# Altium schematic sheet POWER_ANALOG.SchDoc
size 558 x 431 mm; SheetNumber: 21; SheetTotal: 25; Sheet_Name: POWER; Size: 11x17
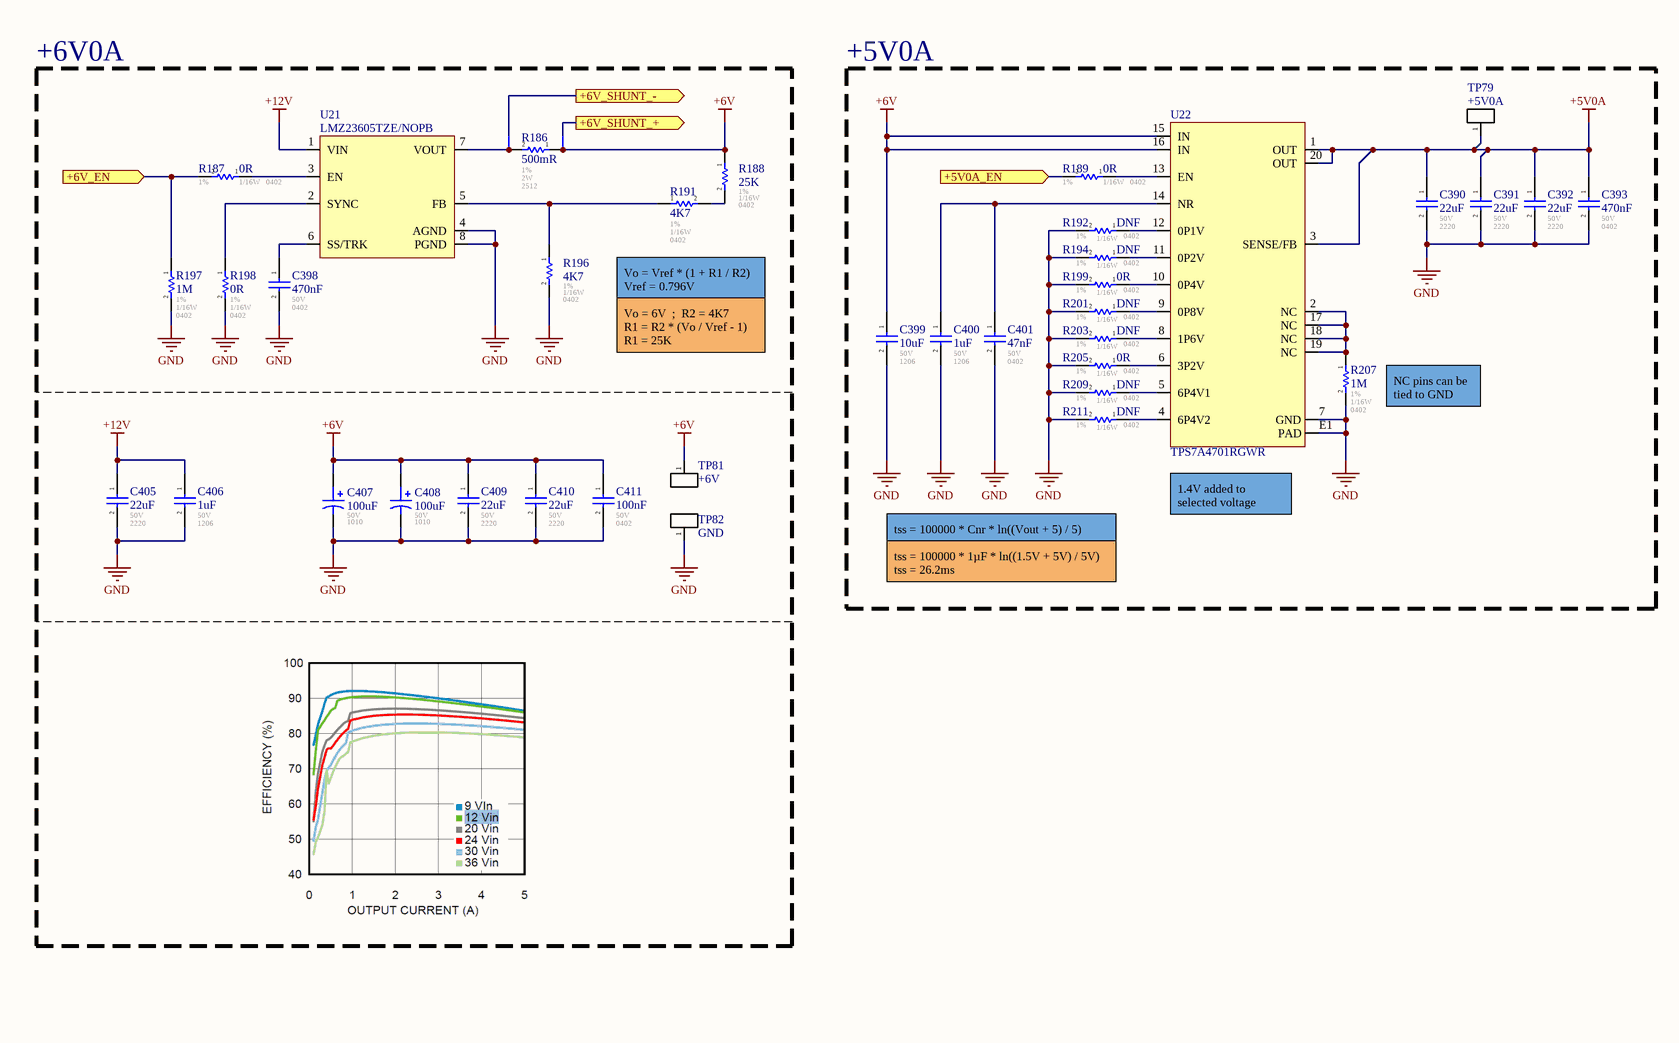
[diagram p0: POWER_ANALOG.SchDoc, top left]
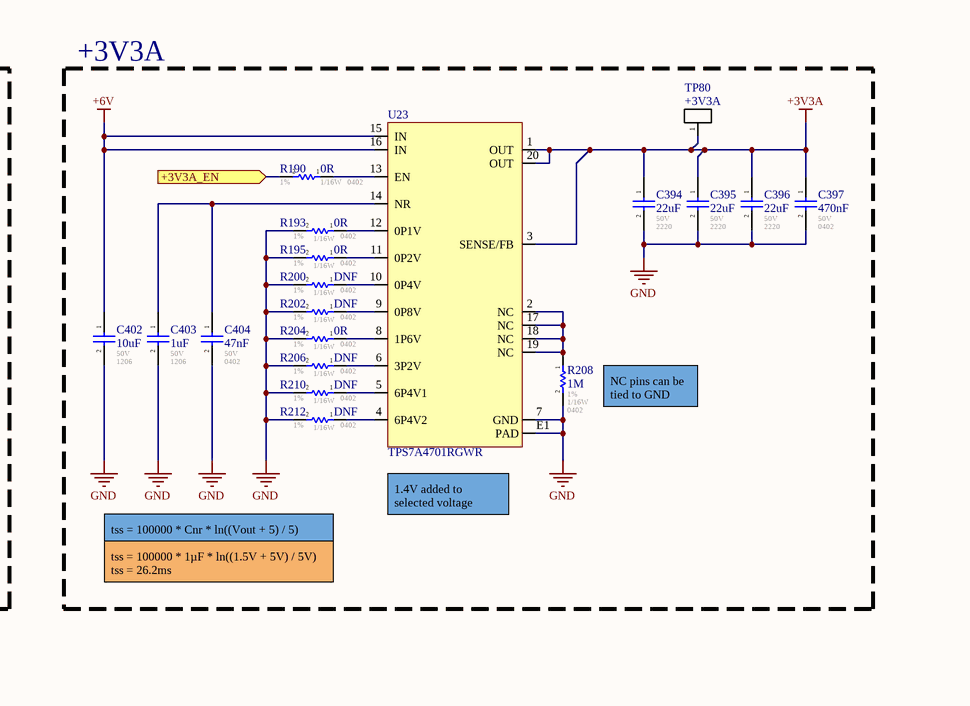
[diagram p1: POWER_ANALOG.SchDoc, top right]
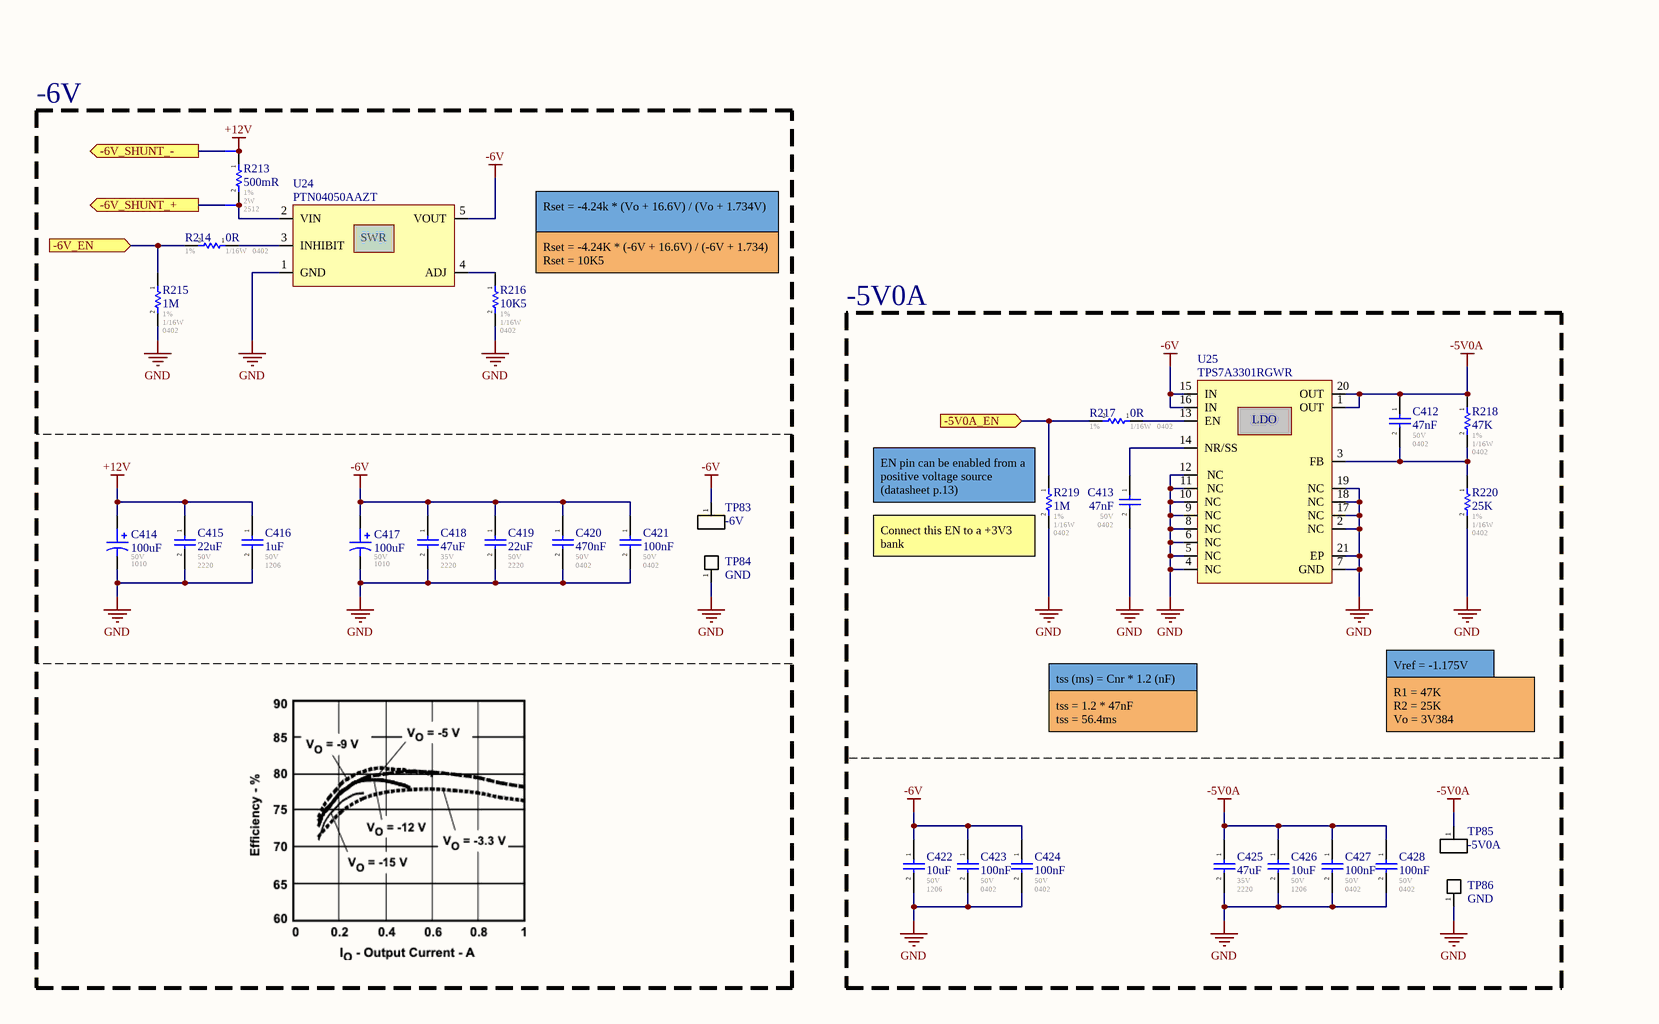
[diagram p2: POWER_ANALOG.SchDoc, bottom left]
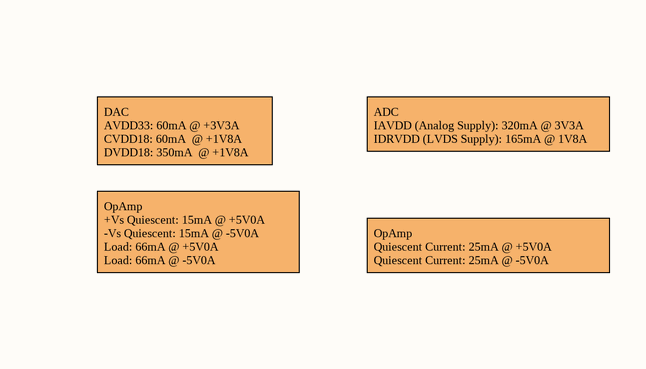
[diagram p3: POWER_ANALOG.SchDoc, bottom right]

## Parts
C390  22uF  Voltage - Rated: 50V  Footprint: 2220  [CAP_2220]
C391  22uF  Voltage - Rated: 50V  Footprint: 2220  [CAP_2220]
C392  22uF  Voltage - Rated: 50V  Footprint: 2220  [CAP_2220]
C393  470nF  Voltage - Rated: 50V  Footprint: 0402  [CAP_0402]
C394  22uF  Voltage - Rated: 50V  Footprint: 2220  [CAP_2220]
C395  22uF  Voltage - Rated: 50V  Footprint: 2220  [CAP_2220]
C396  22uF  Voltage - Rated: 50V  Footprint: 2220  [CAP_2220]
C397  470nF  Voltage - Rated: 50V  Footprint: 0402  [CAP_0402]
C398  470nF  Voltage - Rated: 50V  Footprint: 0402  [CAP_0402]
C399  10uF  Voltage - Rated: 50V  Footprint: 1206  [CAP_1206]
C400  1uF  Voltage - Rated: 50V  Footprint: 1206  [CAP_1206]
C401  47nF  Voltage - Rated: 50V  Footprint: 0402  [CAP_0402]
C402  10uF  Voltage - Rated: 50V  Footprint: 1206  [CAP_1206]
C403  1uF  Voltage - Rated: 50V  Footprint: 1206  [CAP_1206]
C404  47nF  Voltage - Rated: 50V  Footprint: 0402  [CAP_0402]
C405  22uF  Voltage - Rated: 50V  Footprint: 2220  [CAP_2220]
C406  1uF  Voltage - Rated: 50V  Footprint: 1206  [CAP_1206]
C407  value 100uF  Voltage: 50V  Package: 1010  [CAP_ALU_1010_vishay]  (hidden comment: MAL215099101E3)
C408  value 100uF  Voltage: 50V  Package: 1010  [CAP_ALU_1010_vishay]  (hidden comment: MAL215099101E3)
C409  22uF  Voltage - Rated: 50V  Footprint: 2220  [CAP_2220]
C410  22uF  Voltage - Rated: 50V  Footprint: 2220  [CAP_2220]
C411  100nF  Voltage - Rated: 50V  Footprint: 0402  [CAP_0402]
C412  47nF  Voltage - Rated: 50V  Footprint: 0402  [CAP_0402]
C413  47nF  Voltage - Rated: 50V  Footprint: 0402  [CAP_0402]
C414  value 100uF  Voltage: 50V  Package: 1010  [CAP_ALU_1010_vishay]  (hidden comment: MAL215099101E3)
C415  22uF  Voltage - Rated: 50V  Footprint: 2220  [CAP_2220]
C416  1uF  Voltage - Rated: 50V  Footprint: 1206  [CAP_1206]
C417  value 100uF  Voltage: 50V  Package: 1010  [CAP_ALU_1010_vishay]  (hidden comment: MAL215099101E3)
C418  47uF  Voltage - Rated: 35V  Footprint: 2220  [CAP_2220]
C419  22uF  Voltage - Rated: 50V  Footprint: 2220  [CAP_2220]
C420  470nF  Voltage - Rated: 50V  Footprint: 0402  [CAP_0402]
C421  100nF  Voltage - Rated: 50V  Footprint: 0402  [CAP_0402]
C422  10uF  Voltage - Rated: 50V  Footprint: 1206  [CAP_1206]
C423  100nF  Voltage - Rated: 50V  Footprint: 0402  [CAP_0402]
C424  100nF  Voltage - Rated: 50V  Footprint: 0402  [CAP_0402]
C425  47uF  Voltage - Rated: 35V  Footprint: 2220  [CAP_2220]
C426  10uF  Voltage - Rated: 50V  Footprint: 1206  [CAP_1206]
C427  100nF  Voltage - Rated: 50V  Footprint: 0402  [CAP_0402]
C428  100nF  Voltage - Rated: 50V  Footprint: 0402  [CAP_0402]
NT40  Net Tie  [NETTIE_5]  (value not drawn)  (net tie, no BOM)
NT41  Net Tie  [NETTIE_5]  (value not drawn)  (net tie, no BOM)
NT42  Net Tie  [NETTIE_5]  (value not drawn)  (net tie, no BOM)
NT43  Net Tie  [NETTIE_5]  (value not drawn)  (net tie, no BOM)
R186  500mR  Tolerance: 1%  Power: 2W  Package / Case: 2512  [RES_2512]
R187  0R  Tolerance: 1%  Power: 1/16W  Package / Case: 0402  [RES_0402]
R188  25K  Tolerance: 1%  Power: 1/16W  Package / Case: 0402  [RES_0402]
R189  0R  Tolerance: 1%  Power: 1/16W  Package / Case: 0402  [RES_0402]
R190  0R  Tolerance: 1%  Power: 1/16W  Package / Case: 0402  [RES_0402]
R191  4K7  Tolerance: 1%  Power: 1/16W  Package / Case: 0402  [RES_0402]
R192  DNF  Tolerance: 1%  Power: 1/16W  Package / Case: 0402  [RES_0402]
R193  0R  Tolerance: 1%  Power: 1/16W  Package / Case: 0402  [RES_0402]
R194  DNF  Tolerance: 1%  Power: 1/16W  Package / Case: 0402  [RES_0402]
R195  0R  Tolerance: 1%  Power: 1/16W  Package / Case: 0402  [RES_0402]
R196  4K7  Tolerance: 1%  Power: 1/16W  Package / Case: 0402  [RES_0402]
R197  1M  Tolerance: 1%  Power: 1/16W  Package / Case: 0402  [RES_0402]
R198  0R  Tolerance: 1%  Power: 1/16W  Package / Case: 0402  [RES_0402]
R199  0R  Tolerance: 1%  Power: 1/16W  Package / Case: 0402  [RES_0402]
R200  DNF  Tolerance: 1%  Power: 1/16W  Package / Case: 0402  [RES_0402]
R201  DNF  Tolerance: 1%  Power: 1/16W  Package / Case: 0402  [RES_0402]
R202  DNF  Tolerance: 1%  Power: 1/16W  Package / Case: 0402  [RES_0402]
R203  DNF  Tolerance: 1%  Power: 1/16W  Package / Case: 0402  [RES_0402]
R204  0R  Tolerance: 1%  Power: 1/16W  Package / Case: 0402  [RES_0402]
R205  0R  Tolerance: 1%  Power: 1/16W  Package / Case: 0402  [RES_0402]
R206  DNF  Tolerance: 1%  Power: 1/16W  Package / Case: 0402  [RES_0402]
R207  1M  Tolerance: 1%  Power: 1/16W  Package / Case: 0402  [RES_0402]
R208  1M  Tolerance: 1%  Power: 1/16W  Package / Case: 0402  [RES_0402]
R209  DNF  Tolerance: 1%  Power: 1/16W  Package / Case: 0402  [RES_0402]
R210  DNF  Tolerance: 1%  Power: 1/16W  Package / Case: 0402  [RES_0402]
R211  DNF  Tolerance: 1%  Power: 1/16W  Package / Case: 0402  [RES_0402]
R212  DNF  Tolerance: 1%  Power: 1/16W  Package / Case: 0402  [RES_0402]
R213  500mR  Tolerance: 1%  Power: 2W  Package / Case: 2512  [RES_2512]
R214  0R  Tolerance: 1%  Power: 1/16W  Package / Case: 0402  [RES_0402]
R215  1M  Tolerance: 1%  Power: 1/16W  Package / Case: 0402  [RES_0402]
R216  10K5  Tolerance: 1%  Power: 1/16W  Package / Case: 0402  [RES_0402]
R217  0R  Tolerance: 1%  Power: 1/16W  Package / Case: 0402  [RES_0402]
R218  47K  Tolerance: 1%  Power: 1/16W  Package / Case: 0402  [RES_0402]
R219  1M  Tolerance: 1%  Power: 1/16W  Package / Case: 0402  [RES_0402]
R220  25K  Tolerance: 1%  Power: 1/16W  Package / Case: 0402  [RES_0402]
TP79  +5V0A  [TP_HOLE]  (no BOM)
TP80  +3V3A  [TP_HOLE]  (no BOM)
TP81  +6V  [TP_HOLE]  (no BOM)
TP82  GND  [TP_HOLE]  (no BOM)
TP83  -6V  [TP_HOLE]  (no BOM)
TP84  GND  [TP_PAD]  (no BOM)
TP85  -5V0A  [TP_HOLE]  (no BOM)
TP86  GND  [TP_PAD]  (no BOM)
U21  LMZ23605TZE/NOPB  [REG_SWR_LMZ23605TZE/NOPB]
U22  TPS7A4701RGWR  [REG_TPS7A4701RGWR]
U23  TPS7A4701RGWR  [REG_TPS7A4701RGWR]
U24  PTN04050AAZT  [REG_SWR_PTN04050AAZT]
U25  TPS7A3301RGWR  [REG_LDO_TPS7A3301RGWR]

## Blocks framed on the sheet
+6V0A: C398 C405-C411 NT40 NT41 R186-R188 R191 R196-R198 TP81 TP82 U21
+5V0A: C390-C393 C399-C401 R189 R192 R194 R199 R201 R203 R205 R207 R209 R211 TP79 U22
+3V3A: C394-C397 C402-C404 R190 R193 R195 R200 R202 R204 R206 R208 R210 R212 TP80 U23
-6V: C414-C421 NT42 NT43 R213-R216 TP83 TP84 U24
-5V0A: C412 C413 C422-C428 R217-R220 TP85 TP86 U25

## Ports
+3V3A_EN (in), +5V0A_EN (in), +6V_EN (in), +6V_SHUNT_+ (out), +6V_SHUNT_- (out), -5V0A_EN (in), -6V_EN (in), -6V_SHUNT_+ (out), -6V_SHUNT_- (out)

## Nets
+3V3A: C394.1 C395.1 C396.1 C397.1 TP80.1(A) U23.1(OUT) U23.3(SENSE/FB) U23.20(OUT)
+5V0A: C390.1 C391.1 C392.1 C393.1 TP79.1(A) U22.1(OUT) U22.3(SENSE/FB) U22.20(OUT)
+6V: C399.1 C402.1 C407.1 C408.1 C409.1 C410.1 C411.1 NT41.1 R186.1 R188.1 TP81.1(A) U22.15(IN) U22.16(IN) U23.15(IN) U23.16(IN)
+12V: C405.1 C406.1 C414.1 C415.1 C416.1 NT42.1 R213.1 U21.1(VIN)
-5V0A: C412.1 C425.1 C426.1 C427.1 C428.1 R218.1 TP85.1(A) U25.1(OUT) U25.20(OUT)
-6V: C417.1 C418.1 C419.1 C420.1 C421.1 C422.1 C423.1 C424.1 TP83.1(A) U24.5(VOUT) U25.15(IN) U25.16(IN)
GND: C390.2 C391.2 C392.2 C393.2 C394.2 C395.2 C396.2 C397.2 C398.2 C399.2 C400.2 C401.2 C402.2 C403.2 C404.2 C405.2 C406.2 C407.2 C408.2 C409.2 C410.2 C411.2 C413.2 C414.2 C415.2 C416.2 C417.2 C418.2 C419.2 C420.2 C421.2 C422.2 C423.2 C424.2 C425.2 C426.2 C427.2 C428.2 R192.2 R193.2 R194.2 R195.2 R196.2 R197.2 R198.2 R199.2 R200.2 R201.2 R202.2 R203.2 R204.2 R205.2 R206.2 R207.2 R208.2 R209.2 R210.2 R211.2 R212.2 R215.2 R216.2 R219.2 R220.2 TP82.1(A) TP84.1(A) TP86.1(A) U21.4(AGND) U21.8(PGND) U22.7(GND) U22.E1(PAD) U23.7(GND) U23.E1(PAD) U24.1(GND) U25.2(NC) U25.4(NC) U25.5(NC) U25.6(NC) U25.7(GND) U25.8(NC) U25.9(NC) U25.10(NC) U25.11(NC) U25.12(NC) U25.17(NC) U25.18(NC) U25.19(NC) U25.21(EP)
+3V3A_EN: R190.2 ; port +3V3A_EN
+5V0A_EN: R189.2 ; port +5V0A_EN
+6V_EN: R187.2 R197.1 ; port +6V_EN
+6V_SHUNT_+: NT41.2 ; port +6V_SHUNT_+
+6V_SHUNT_-: NT40.2 ; port +6V_SHUNT_-
-5V0A_EN: R217.2 R219.1 ; port -5V0A_EN
-6V_EN: R214.2 R215.1 ; port -6V_EN
-6V_SHUNT_+: NT43.2 ; port -6V_SHUNT_+
-6V_SHUNT_-: NT42.2 ; port -6V_SHUNT_-
NetC398_1: C398.1 U21.6(SS/TRK)
NetC400_1: C400.1 C401.1 U22.14(NR)
NetC403_1: C403.1 C404.1 U23.14(NR)
NetC412_2: C412.2 R218.2 R220.1 U25.3(FB)
NetC413_1: C413.1 U25.14(NR/SS)
NetNT40_1: NT40.1 R186.2 U21.7(VOUT)
NetNT43_1: NT43.1 R213.2 U24.2(VIN)
NetR187_1: R187.1 U21.3(EN)
NetR188_2: R188.2 R191.2
NetR189_1: R189.1 U22.13(EN)
NetR190_1: R190.1 U23.13(EN)
NetR191_1: R191.1 R196.1 U21.5(FB)
NetR192_1: R192.1 U22.12(0P1V)
NetR193_1: R193.1 U23.12(0P1V)
NetR194_1: R194.1 U22.11(0P2V)
NetR195_1: R195.1 U23.11(0P2V)
NetR198_1: R198.1 U21.2(SYNC)
NetR199_1: R199.1 U22.10(0P4V)
NetR200_1: R200.1 U23.10(0P4V)
NetR201_1: R201.1 U22.9(0P8V)
NetR202_1: R202.1 U23.9(0P8V)
NetR203_1: R203.1 U22.8(1P6V)
NetR204_1: R204.1 U23.8(1P6V)
NetR205_1: R205.1 U22.6(3P2V)
NetR206_1: R206.1 U23.6(3P2V)
NetR207_1: R207.1 U22.2(NC) U22.17(NC) U22.18(NC) U22.19(NC)
NetR208_1: R208.1 U23.2(NC) U23.17(NC) U23.18(NC) U23.19(NC)
NetR209_1: R209.1 U22.5(6P4V1)
NetR210_1: R210.1 U23.5(6P4V1)
NetR211_1: R211.1 U22.4(6P4V2)
NetR212_1: R212.1 U23.4(6P4V2)
NetR214_1: R214.1 U24.3(INHIBIT)
NetR216_1: R216.1 U24.4(ADJ)
NetR217_1: R217.1 U25.13(EN)

## Notes on the sheet
- Vo = Vref * (1 + R1 / R2)
  Vref = 0.796V
- Vo = 6V  ;  R2 = 4K7
  R1 = R2 * (Vo / Vref - 1)
  R1 = 25K
- (near R207) NC pins can be tied to GND
- (near R208) NC pins can be tied to GND
- tss = 100000 * Cnr * ln((Vout + 5) / 5)
- (near U22) 1.4V added to selected voltage
- (near U23) 1.4V added to selected voltage
- tss = 100000 * 1µF * ln((1.5V + 5V) / 5V)
  tss = 26.2ms
- Rset = -4.24k * (Vo + 16.6V) / (Vo + 1.734V)
- (near R216) Rset = -4.24K * (-6V + 16.6V) / (-6V + 1.734)
  Rset = 10K5
- (near R219) EN pin can be enabled from a positive voltage source
  (datasheet p.13)
- (near R219) Connect this EN to a +3V3 bank
- Vref = -1.175V
- ADC
  IAVDD (Analog Supply): 320mA @ 3V3A
  IDRVDD (LVDS Supply): 165mA @ 1V8A
- tss (ms) = Cnr * 1.2 (nF)
- tss = 1.2 * 47nF
  tss = 56.4ms
- R1 = 47K
  R2 = 25K
  Vo = 3V384
- DAC
  AVDD33: 60mA @ +3V3A
  CVDD18: 60mA  @ +1V8A
  DVDD18: 350mA  @ +1V8A
- OpAmp
  +Vs Quiescent: 15mA @ +5V0A
  -Vs Quiescent: 15mA @ -5V0A
  Load: 66mA @ +5V0A
  Load: 66mA @ -5V0A
- OpAmp
  Quiescent Current: 25mA @ +5V0A
  Quiescent Current: 25mA @ -5V0A
- Sheet Name
- Project Title
- Global Project
- Revision
- Size
- Date
- Group
- Sheet
- of
- Filename
- Designers
- (in symbol REG_LDO_TPS7A3301RGWR) LDO
- (in symbol REG_SWR_PTN04050AAZT) SWR

## Library data of the parts
C390-C392 C394-C396 C405 C409 C410 C415 C419 = CAP_CER: CGA9P3X7R1H226M250KB / 2220 22uF 20% X7R Ceramic Capacitor; Mfr: TDK; Operating Temperature: -55C - 125C; Temperature Coefficient: X7R; ComponentLink1Description: Digikey; ComponentLink1URL: https://www.digikey.ca/en/products/detail/tdk-corporation/CGA9P3X7R1H226M250KB/10240627; ComponentLink2Description: Datasheet; ComponentLink2URL: https://product.tdk.com/system/files/dam/doc/product/capacitor/ceramic/mlcc/charasheet/cga9p3x7r1h226m250kb.pdf; Tolerance: 20%; Ratings: AEC-Q200; Part#: CGA9P3X7R1H226M250KB; Supplier 1: Arrow Electronics; Supplier Part Number 1: CGA9P3X7R1H226M250KB; ComponentLink3Description: TDK; ComponentLink3URL: https://product.tdk.com/en/search/capacitor/ceramic/mlcc/info?part_no=CGA9P3X7R1H226M250KB; ComponentLink4Description: Octopart; ComponentLink4URL: https://octopart.com/cga9p3x7r1h226m250kb-tdk-102764996?r=sp
C393 C397 C398 C420 = CAP_CER: CGA3E3X7R1H474K080AB / 0603 470nF 10% X7R Ceramic Capacitor; Mfr: TDK; Operating Temperature: -55C - 125C; Temperature Coefficient: X7R; ComponentLink1Description: Digikey; ComponentLink1URL: [Digikey Link]; Part#: CGA3E3X7R1H474K080AB; ComponentLink2Description: Datasheet; ComponentLink2URL: [Datasheet Link]; Tolerance: 10%; Ratings: AEC-Q200
C399 C402 C422 C426 = CAP_CER: GRT31CR61H106KE01L / 1206 10uF 10% X5R Ceramic Capacitor; Mfr: Murata; Operating Temperature: -55C - 85C; Temperature Coefficient: X5R; ComponentLink1Description: Digikey; ComponentLink1URL: [Digikey Link]; ComponentLink2Description: Datasheet; ComponentLink2URL: [Datasheet Link]; Tolerance: 10%; Ratings: AEC-Q200; Supplier 1: Arrow Electronics; Supplier Part Number 1: GRT31CR61H106KE01L; Part#: GRT31CR61H106KE01L
C400 C403 C406 C416 = CAP_CER: GCJ31CR71H105KA12L / 1206 1uF 10% X7R Ceramic Capacitor; Mfr: Murata; Operating Temperature: -55C - 125C; Temperature Coefficient: X7R; ComponentLink1Description: Digikey; ComponentLink1URL: [Digikey Link]; Part#: GCJ31CR71H105KA12L; ComponentLink2Description: Datasheet; ComponentLink2URL: [Datasheet Link]; Tolerance: 10%; Ratings: AEC-Q200
C401 C404 C412 C413 = CAP_CER: GCM155R71H473KE02J / 0402 47nF 10% X7R Ceramic Capacitor; Mfr: Murata; Operating Temperature: -55C - 125C; Temperature Coefficient: X7R; ComponentLink1Description: Digikey; ComponentLink1URL: [Digikey Link]; Part#: GCM155R71H473KE02J; ComponentLink2Description: Datasheet; ComponentLink2URL: [Datasheet Link]; Tolerance: 10%; Ratings: AEC-Q200
C407 C408 C414 C417 = CAP_ALU_MAL215099101E3: CAP - ALU 100uF 20% 50V - 1010; Current: 490mA; Mfg: Vishay Dale; Mfg Part Number: MAL215099101E3; HelpURL: http://www.vishay.com/docs/28395/150crz.pdf; CreatedBy: Jonathan Bouchard; Temperature: -55°C to 125°C; Power: *; Supplier 1: Digikey; Supplier Part Number 1: 4399PHDKR-ND; Precision: 20%
C411 C421 C423 C424 C427 C428 = CAP_CER: GCM155R71H104KE02J / 0402 100nF 10% X7R Ceramic Capacitor; Mfr: Murata; Operating Temperature: -55C - 125C; Temperature Coefficient: X7R; ComponentLink1Description: Digikey; ComponentLink1URL: [Digikey Link]; Part#: GCM155R71H104KE02J; ComponentLink2Description: Datasheet; ComponentLink2URL: [Datasheet Link]; Tolerance: 10%; Ratings: AEC-Q200
C418 C425 = CAP_CER: CGA9N1X7R1V476M230KC / 2220 47uF 20% X7R Ceramic Capacitor; Mfr: TDK; Operating Temperature: -55C - 125C; Temperature Coefficient: X7R; ComponentLink1Description: Digikey; ComponentLink1URL: https://www.digikey.ca/en/products/detail/tdk-corporation/CGA9N1X7R1V476M230KC/15930202; ComponentLink2Description: Datasheet; ComponentLink2URL: https://product.tdk.com/system/files/dam/doc/product/capacitor/ceramic/mlcc/catalog/mlcc_automotive_general_en.pdf; Tolerance: 20%; Ratings: AEC-Q200; Part#: CGA9N1X7R1V476M230KC; ComponentLink3Description: TDK; ComponentLink3URL: https://product.tdk.com/en/search/capacitor/ceramic/mlcc/info?part_no=CGA9N1X7R1V476M230KC; ComponentLink4Description: Octopart; ComponentLink4URL: https://octopart.com/cga9n1x7r1v476m230kc-tdk-122377816?r=sp; Supplier 1: Newark; Supplier Part Number 1: 57AK9414
NT40-NT43 = NET_TIE_SMALL
R186 R213 = RESISTOR: Part #: CSRN2512FKR500; Automotive: AEC-Q200; Operating Temperature: -55C - 155C; ComponentLink1Description: Digikey; ComponentLink1URL: https://www.digikey.ca/fr/products/detail/stackpole-electronics-inc/CSRN2512FKR500/1742768
R187-R196 R198-R206 R209-R212 R214 R216-R218 R220 = RESISTOR: Automotive: AEC-Q200; Operating Temperature: *; # Digikey: *; ComponentLink1Description: Digikey; ComponentLink1URL: *; # Manufacturer: *
R197 R207 R208 R215 R219 = RESISTOR: 1M 0402 1% 1/16W Resistor; Automotive: AEC-Q200; Operating Temperature: *; # Digikey: *; ComponentLink1Description: Digikey; ComponentLink1URL: *; # Manufacturer: *
TP79-TP83 TP85 = TESTPOINT: Test Point; ClassName: Testpoint
TP84 TP86 = TESTPOINT_PAD: Test Point
U21 = REG_SWR_LMZ23605TZE/NOPB: REG - IC BUCK SYNC 36V 5A - TO-PMOD-7; Manufacturer #1: Texas Instruments; Value: 0.8 ~ 6 V; Voltage Rating: 6 ~ 36 V; GRAMS Lib Spec: 2.8; Note: One Reflow; Magnetic Material: YES; Cryo: UNKNOWN; Tolerance: *; Current Rating: 5A; Power Max: *; HelpURL: http://www.ti.com/lit/ds/symlink/lmz23605.pdf; CreatedBy/Date: Arnaud Samson - 05/07/18; VerifiedBy: Jonathan Bouchard 2018-07-13; Temperature: -40°C ~ 125°C; Package: TO-PMOD-7; Manufacturer #2: *; Assembly Type: SMD; Part Number #2: *; Part Number #1: LMZ23605TZE/NOPB; Polarized: YES; Supplier 1: Digi-Key; Supplier Part Number 1: 296-35357-1-ND
U22 U23 = REG_LDO_TPS7A4701RGWR: REG - LINEAR POS ADJ 1A - 20VQFN; Manufacturer #1: Texas Instruments; GRAMS Lib Spec: 2.8; Magnetic Material: Unknown; Polarized: Yes; Value: 1.4 à 34V; Voltage rating: 35V max; Assembly Type: SMD; CreatedBy/Date: L-P Gauthier / 2018-05-29; Current Rating: 1A; Manufacturer #2: TBD; Part Number #1: TPS7A4701RGWR; Part Number #2: TBD; Package: 20-VQFN Exposed Pad; Power Max: *; Tolerance: -; Supplier 1: Digi-Key; Supplier Part Number 1: 296-37224-1-ND; VerifiedBy: Caroline Paulin - 28 sept 2018; Temperature: -40°C ~ 125°C; HelpURL: http://www.ti.com/lit/ds/symlink/tps7a47.pdf; Cryo: UNKNOWN
U24 = REG_SWR_PTN04050AAZT: REG - SWR -15 ~ -3.3V 1A 6W - 5-SMD; Manufacturer #1: Texas Instruments; Voltage Rating: 2.9V~7Vin; GRAMS Lib Spec: 2.8; Magnetic Material: Unknown; Polarized: Yes; Value: -15 ~ -3.3V; Tolerance: *; Current Rating: 1A; Power Max: 6W; HelpURL: http://www.ti.com/lit/ds/symlink/ptn04050a.pdf; CreatedBy/Date: Ihsane Najahi 2019-09-25; VerifiedBy: C.Paulin (9-10-2019); Temperature: -40°C ~ 85°C; Package: 5-SMD; Manufacturer #2: *; Note: *; Assembly Type: 5-SMD; Part Number #2: *; Part Number #1: PTN04050AAZT; Supplier 1: Digi-Key; Supplier Part Number 1: 296-32208-1-ND; Cryo: UNKNOWN
U25 = REG_LDO_TPS7A3301RGWR: REG - LDO Negative Adjustable 1 Output -1.18V-33V 1A -  20-VQFN (5x5); Manufacturer #1: Texas Instruments; Value: -1.18V~-33V; Voltage Rating: -36V; GRAMS Lib Spec: 2.8; Magnetic Material: Unknown; Polarized: Yes; Tolerance: *; Current Rating: 1A; Power Max: *; HelpURL: http://www.ti.com/lit/ds/symlink/tps7a33.pdf; CreatedBy/Date: Keven Deslandes - 2018/10/11; VerifiedBy: Caroline Paulin - 11/12/2018; Temperature: -40°C ~ 125°C; Package: 20-VQFN; Manufacturer #2: *; Assembly Type: SMD; Part Number #2: *; Part Number #1: TPS7A3301RGWR; Supplier 1: Digi-Key; Supplier Part Number 1: 296-39502-1-ND; Cryo: UNKNOWN